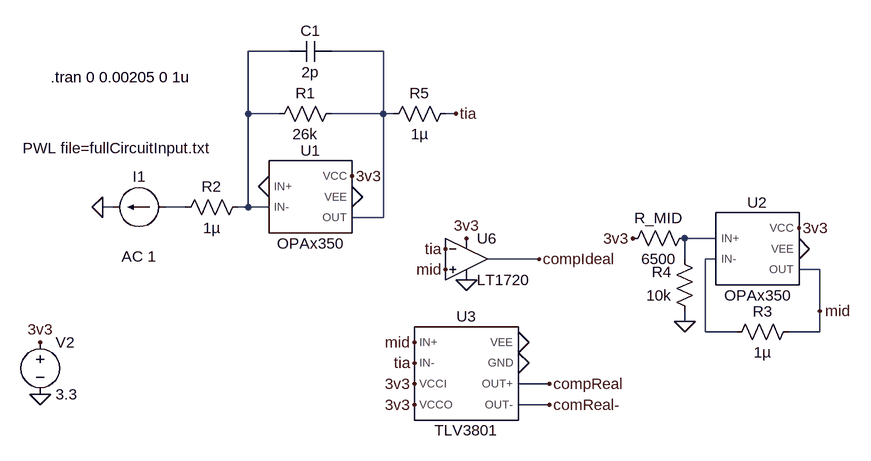
[diagram p0: schematic circuitF.asc]
circuitF.asc, the LTspice schematic file:
Version 4.1
SHEET 1 3920 1676
WIRE 2352 800 2288 800
WIRE 2496 800 2416 800
WIRE 2288 896 2288 800
WIRE 2336 896 2288 896
WIRE 2496 896 2496 800
WIRE 2496 896 2416 896
WIRE 2512 896 2496 896
WIRE 2608 896 2592 896
WIRE 2080 1040 2064 1040
WIRE 2192 1040 2160 1040
WIRE 2288 1040 2288 896
WIRE 2288 1040 2272 1040
WIRE 2320 1040 2288 1040
WIRE 2496 1056 2496 896
WIRE 2496 1056 2448 1056
WIRE 3008 1088 2960 1088
WIRE 2736 1120 2656 1120
WIRE 2960 1120 2960 1088
WIRE 3008 1120 2992 1120
WIRE 3168 1136 3136 1136
WIRE 3168 1200 3168 1136
WIRE 2960 1216 2960 1200
WIRE 2992 1232 2992 1120
WIRE 3040 1232 2992 1232
WIRE 3168 1232 3168 1200
WIRE 3168 1232 3120 1232
WIRE 2752 1312 2704 1312
WIRE 2752 1344 2704 1344
FLAG 2448 992 3v3
FLAG 2448 1024 0
FLAG 2064 1040 0
FLAG 1968 1328 0
FLAG 1968 1248 3v3
FLAG 2320 1008 0
FLAG 2608 896 tia
FLAG 2544 1312 3v3
FLAG 2544 1344 3v3
FLAG 2704 1248 0
FLAG 2704 1280 0
FLAG 2960 1216 0
FLAG 2880 1088 3v3
FLAG 3136 1072 3v3
FLAG 3136 1104 0
FLAG 3168 1200 mid
FLAG 2544 1248 mid
FLAG 2592 1136 mid
FLAG 2592 1104 tia
FLAG 2544 1280 tia
FLAG 2624 1088 3v3
FLAG 2624 1152 0
FLAG 2736 1120 compIdeal
FLAG 2752 1312 compReal
FLAG 2752 1344 comReal-
SYMBOL res 2432 880 R90
WINDOW 0 0 56 VBottom 2
WINDOW 3 32 56 VTop 2
SYMATTR InstName R1
SYMATTR Value 26k
SYMBOL cap 2416 784 R90
WINDOW 0 0 32 VBottom 2
WINDOW 3 32 32 VTop 2
SYMATTR InstName C1
SYMATTR Value 2p
SYMBOL res 2288 1024 R90
WINDOW 0 0 56 VBottom 2
WINDOW 3 32 56 VTop 2
SYMATTR InstName R2
SYMATTR Value 1µ
SYMBOL current 2160 1040 R90
WINDOW 0 -32 40 VBottom 2
WINDOW 3 -107 75 VTop 2
WINDOW 123 60 40 VTop 2
WINDOW 39 0 0 Left 0
SYMATTR InstName I1
SYMATTR Value PWL file=fullCircuitInput.txt
SYMATTR Value2 AC 1
SYMBOL LTSpiceModels\\sbom071e\\OPAx350 2384 1024 R0
SYMATTR InstName U1
SYMBOL voltage 1968 1232 R0
WINDOW 123 0 0 Left 0
WINDOW 39 0 0 Left 0
SYMATTR InstName V2
SYMATTR Value 3.3
SYMBOL LTSpiceModels\\snom740a\\TLV3801v3\\TLV3801 2624 1296 R0
SYMATTR InstName U3
SYMBOL Comparators\\LT1720 2624 1056 R0
SYMATTR InstName U6
SYMBOL LTSpiceModels\\sbom071e\\OPAx350 3072 1104 R0
SYMATTR InstName U2
SYMBOL res 2976 1072 R90
WINDOW 0 0 56 VBottom 2
WINDOW 3 32 56 VTop 2
SYMATTR InstName R_MID
SYMATTR Value 6500
SYMBOL res 2976 1216 R180
WINDOW 0 36 76 Left 2
WINDOW 3 36 40 Left 2
SYMATTR InstName R4
SYMATTR Value 10k
SYMBOL res 3136 1216 R90
WINDOW 0 0 56 VBottom 2
WINDOW 3 32 56 VTop 2
SYMATTR InstName R3
SYMATTR Value 1µ
SYMBOL res 2608 880 R90
WINDOW 0 0 56 VBottom 2
WINDOW 3 32 56 VTop 2
SYMATTR InstName R5
SYMATTR Value 1µ
TEXT 1984 840 Left 2 !.tran 0 0.00205 0 1u

The netlist it stands for:
* circuitF.asc
R1 N002 N001 26k
C1 N002 N001 2p
R2 N001 N003 1µ
I1 N003 0 PWL file=fullCircuitInput.txt AC 1
X§U1 0 N001 3v3 0 N002 OPAx350  ; pins IN+ IN- VCC VEE OUT
V2 3v3 0 3.3
X§U3 mid tia 3v3 3v3 0 0 compReal comReal- TLV3801  ; pins IN+ IN- VCCI VCCO VEE GND OUT+ OUT-
X§U6 mid tia 3v3 0 compIdeal LT1720  ; pins In+ In- V+ V- OUT
X§U2 N004 N005 3v3 0 mid OPAx350  ; pins IN+ IN- VCC VEE OUT
R_MID N004 3v3 6500
R4 0 N004 10k
R3 mid N005 1µ
R5 tia N002 1µ
.tran 0 0.00205 0 1u
.lib C:\Users\jpulu\OneDrive\Área de Trabalho\TCC\LTSpiceModels\sbom071e\OPAx350.LIB
.lib C:\Users\jpulu\OneDrive\Área de Trabalho\TCC\LTSpiceModels\snom740a\TLV3801v3\tlv3801.lib
.lib LT1720.sub
.backanno
.end